# Altium project TS-04 Touch Module.PrjPcb
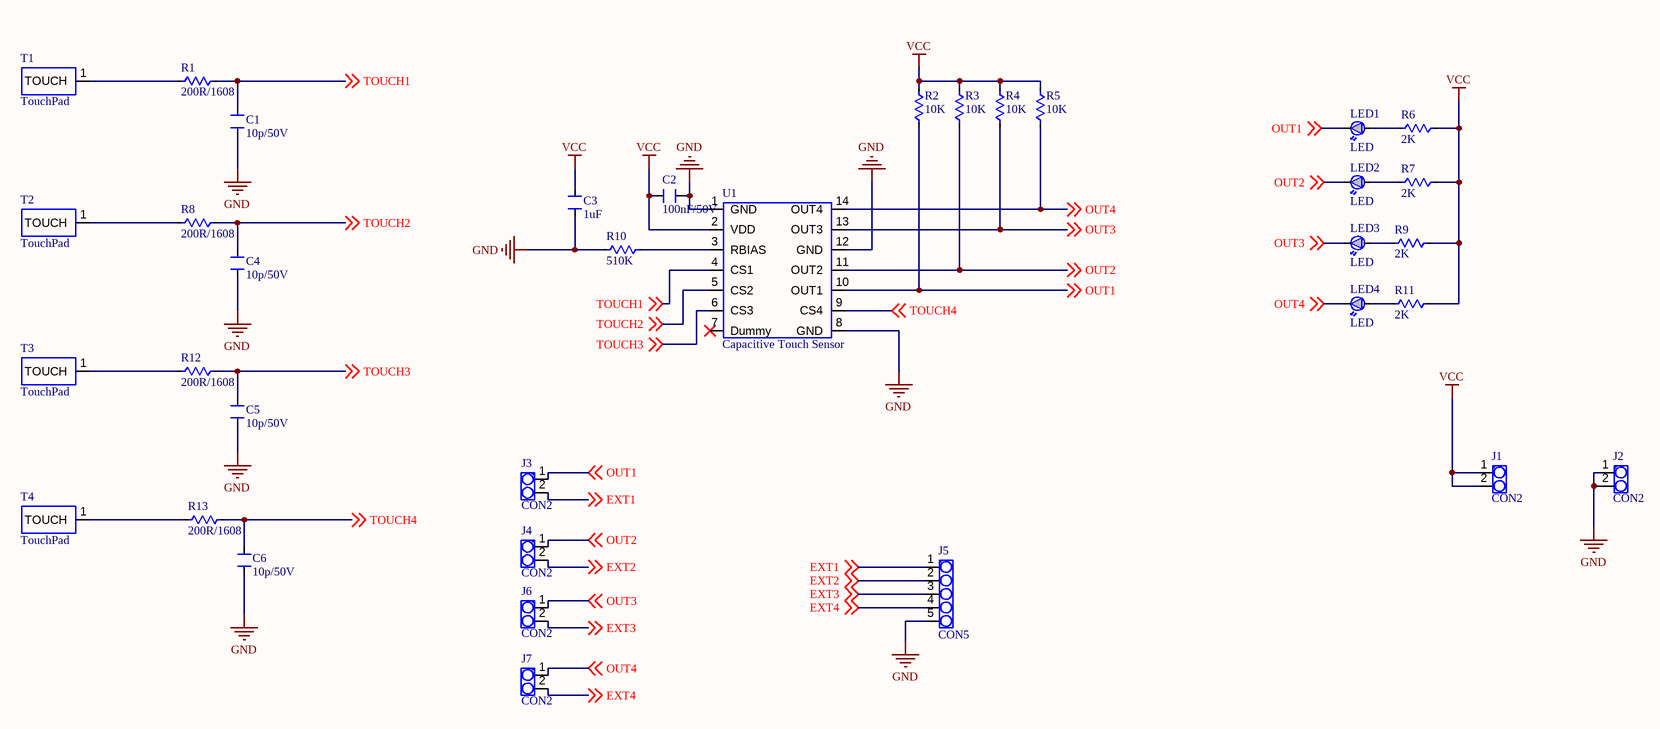
[diagram p0: TS04.SchDoc]
1 sheet, 35 parts. Net scope: global (net labels, ports and power ports of the same name join across sheets).
Board file: TS04.PcbDoc

## Sheet TS04.SchDoc
size 431 x 279 mm; SheetNumber: 1; SheetTotal: 1

### Parts
C1  10p/50V  [C1608]
C2  100nF/50V  [C1608]
C3  1uF  [C1608]
C4  10p/50V  [C1608]
C5  10p/50V  [C1608]
C6  10p/50V  [C1608]
J1  CON2  [HEADER_V254_1X2]
J2  CON2  [HEADER_V254_1X2]
J3  CON2  [HEADER_V254_1X2]
J4  CON2  [HEADER_V254_1X2]
J5  CON5  [HEADER_V254_1X5]
J6  CON2  [HEADER_V254_1X2]
J7  CON2  [HEADER_V254_1X2]
LED1  LED  [LED/SMD1608]
LED2  LED  [LED/SMD1608]
LED3  LED  [LED/SMD1608]
LED4  LED  [LED/SMD1608]
R1  200R/1608  [R1608]
R2  10K  [R1608]
R3  10K  [R1608]
R4  10K  [R1608]
R5  10K  [R1608]
R6  2K  [R1608]
R7  2K  [R1608]
R8  200R/1608  [R1608]
R9  2K  [R1608]
R10  510K  [R1608]
R11  2K  [R1608]
R12  200R/1608  [R1608]
R13  200R/1608  [R1608]
T1  TouchPad  [TOUCHPAD]
T2  TouchPad  [TOUCHPAD]
T3  TouchPad  [TOUCHPAD]
T4  TouchPad  [TOUCHPAD]
U1  Capacitive Touch Sensor  [TS04_SOP14]

### Nets
GND: C1.2 C2.2 C3.1 C4.2 C5.2 C6.2 J2.1 J2.2 J5.5 R10.1 U1.1(GND) U1.8(GND) U1.12(GND)
VCC: C2.1 C3.2 J1.1 J1.2 R2.2 R3.2 R4.2 R5.2 R6.1 R7.1 R9.1 R11.1 U1.2(VDD)
EXT1: J3.2 J5.1 ; off-sheet EXT1
EXT2: J4.2 J5.2 ; off-sheet EXT2
EXT3: J5.3 J6.2 ; off-sheet EXT3
EXT4: J5.4 J7.2 ; off-sheet EXT4
OUT1: J3.1 LED1.1(C) R2.1 U1.10(OUT1) ; off-sheet OUT1
OUT2: J4.1 LED2.1(C) R3.1 U1.11(OUT2) ; off-sheet OUT2
OUT3: J6.1 LED3.1(C) R4.1 U1.13(OUT3) ; off-sheet OUT3
OUT4: J7.1 LED4.1(C) R5.1 U1.14(OUT4) ; off-sheet OUT4
TOUCH1: C1.1 R1.2 U1.4(CS1) ; off-sheet TOUCH1
TOUCH2: C4.1 R8.2 U1.5(CS2) ; off-sheet TOUCH2
TOUCH3: C5.1 R12.2 U1.6(CS3) ; off-sheet TOUCH3
TOUCH4: C6.1 R13.2 U1.9(CS4) ; off-sheet TOUCH4
NetLED1_2: LED1.2(A) R6.2
NetLED2_2: LED2.2(A) R7.2
NetLED3_2: LED3.2(A) R9.2
NetLED4_2: LED4.2(A) R11.2
NetR1_1: R1.1 T1.1(TOUCH)
NetR8_1: R8.1 T2.1(TOUCH)
NetR10_2: R10.2 U1.3(RBIAS)
NetR12_1: R12.1 T3.1(TOUCH)
NetR13_1: R13.1 T4.1(TOUCH)

Not connected (* = marked no-connect by the designer): U1 7(Dummy)*

### Notes on the sheet
- DWG. NO.
- REV.
- SHT.
- THIS DOCUMENT AND THE DATA DISCLOSED HEREIN OR HEREWITH IS THE PROPERTY OF ALTIUM LIMITED AND MAY BE FREELY DISTRIBUTED IN WHOLE. NO RIGHTS ARE RESERVED OR EXPRESS OR IMPLIED WARANTEE GIVEN.
- REVISION
- DESCRIPTION
- DATE
- APPROVED
- ENG:
- APPROVALS
- PROJECT
- DSN:
- CHK:
- REFERENCE DOCUMENTS
- PROJECT REVISION:
- TITLE
- DOCUMENT REVISION:
- DESIGN ITEM:
- BOM:
- FAB DWG:
- PCB DWG:
- ASSY DWG:
- SCALE:
- SIZE
- B
- CAGE CODE
- FILE NAME
- DWG NO.
- SHEET
- OF
- REV

### Library data of the parts
C1-C6 = CHIP_CAP: SMD TYPE CAPACITOR; Value: 100; Manufacturer #1: *
R1-R13 = CHIP_RES: SMD TYPE RESISTOR; VALUE: 100; Manufacturer #1: *; PART DESC: *
U1 = TS04_SOP14: Capacitive Touch Sensor from AD Semiconductor SOP14 Type
LED1-LED4 = LED: Manufacturer #1: *; Value: *